# EAGLE board Maduino Zero 4G LTE CAT4 SIM7600X-H v1.3 (EAGLE 6.1)
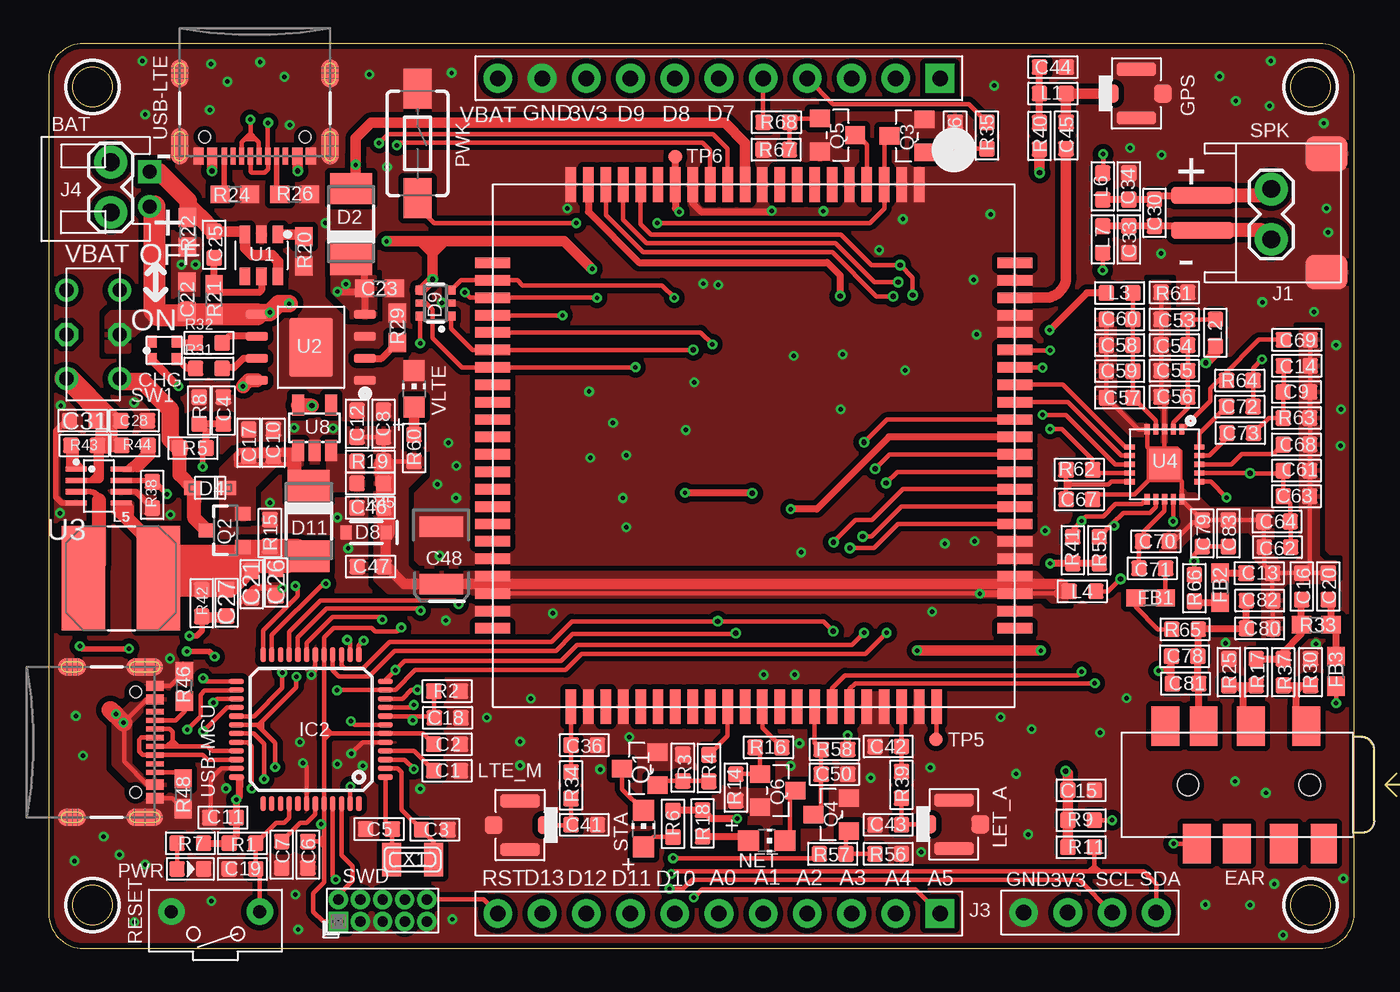
[diagram p2: board, top side]
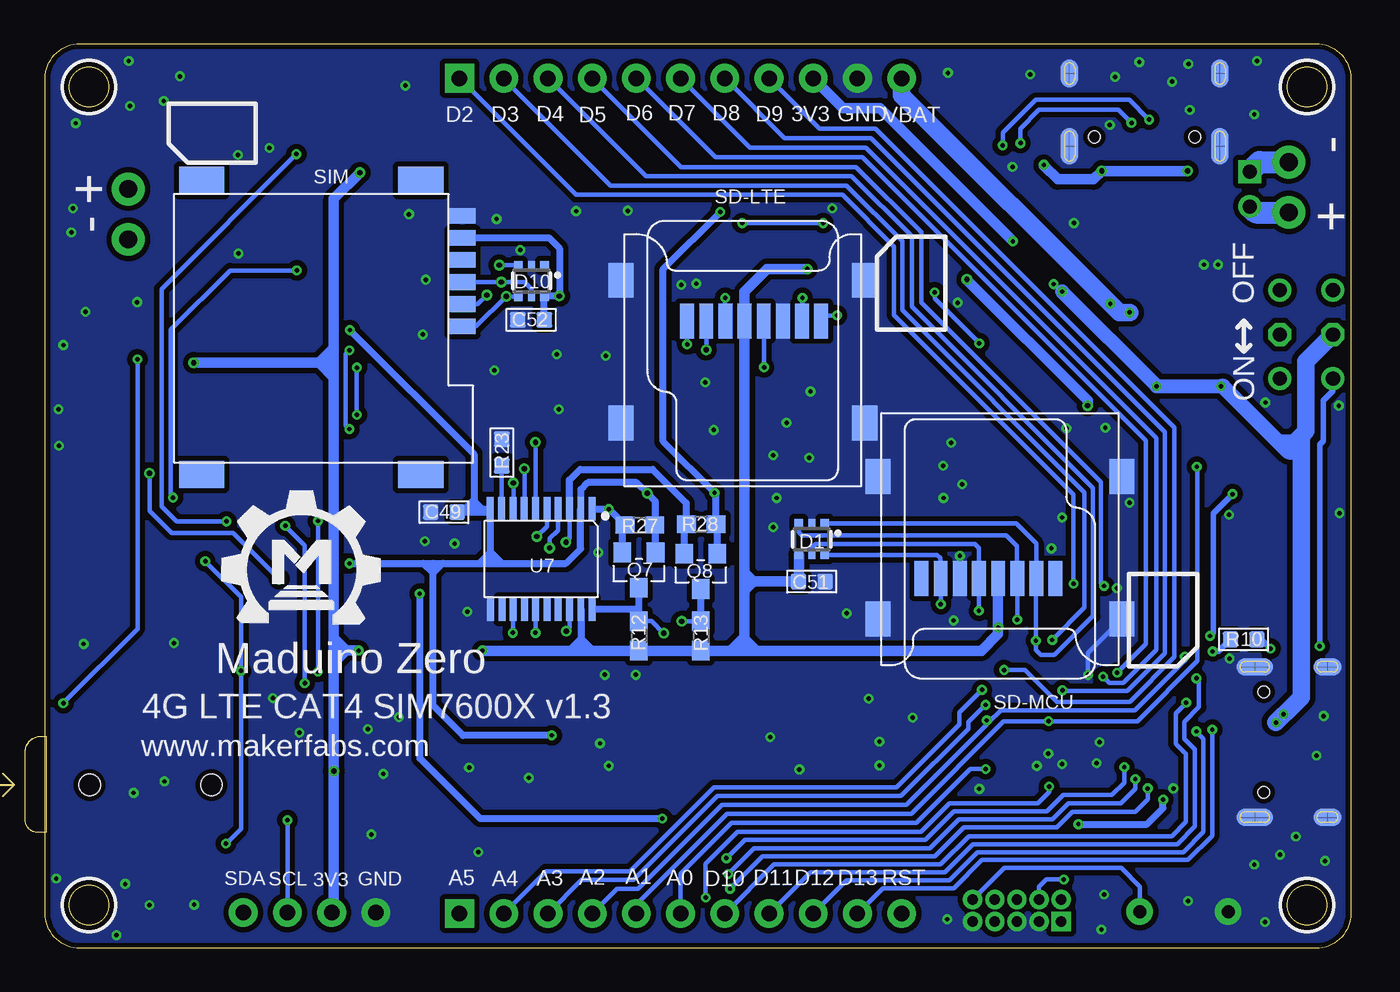
[diagram p3: board, bottom side, seen from below]

Size 75 x 52 mm. Coordinates in mm from the lower left corner, seen from the top.
Outline: 2,0 73,0 arc90 75,2 75,50 arc90 73,52 2,52 arc90 0,50 0,2 arc90 2,0
Outline: circle at 72.5,2.5 radius 1.14
Outline: circle at 72.5,49.5 radius 1.14
Outline: circle at 2.5,2.5 radius 1.14
Outline: circle at 2.5,49.5 radius 1.14
Copper layers (1*16): Top 0.035mm / dielectric 1.5mm / Bottom 0.035mm
Design rules: minimum track width 6mil, minimum drill 10mil, track to track 6mil, track to pad 6mil, pad to pad 6mil, via to via 6mil, smd to smd 0mil, copper to edge 10mil, drill to drill 10mil, minimum pad ring 10mil, minimum via ring 6mil, stop-mask expansion 2mil, vias tented up to drill 30mil, thermal gap 0mil
Net classes: 0 default: width 0.203 mm; 2 gnd: width 0.305 mm, drill 0.559 mm, clearance 0.254 mm; 3 usbvcc: width 0.508 mm, drill 0.61 mm, clearance 0.254 mm; 4 USBpair: width 0.254 mm, drill 0.406 mm, clearance 0.406 mm

## Footprints (pad centres in the part's own frame; a part is rotated, then mirrored left to right if it is on the bottom)
PH2.0-2P-90-DIP = drill 0.8 square: 1 0,1 | drill 0.8: 2 0,-1
0603 = smd 0.889 x 0.889: 1 -0.762,0; 2 0.762,0
0603' = smd 1.1 x 1: 1 -0.85,0; 2 0.85,0
C0603 = smd 0.889 x 0.889: 1 0,0.762; 2 0,-0.762
EIA3528 = smd 1.2 x 2.5: A 1.65,0; C -1.65,0
SMD4-160L160W = smd 0.6 x 0.7: 1 -0.7,0.5; 2 0.7,0.5; 3 -0.7,-0.5; 4 0.7,-0.5
PINHEAD_2X05_127 = drill 0.6 pad 1.016 square: 1 -0.635,2.54 | drill 0.6 pad 1.016: 2 0.635,2.54; 3 -0.635,1.27; 4 0.635,1.27; 5 -0.635,0; 6 0.635,0; 7 -0.635,-1.27; 8 0.635,-1.27; 9 -0.635,-2.54; 10 0.635,-2.54
SOT363 = smd 0.5 x 0.5: 1 -0.75,-0.9; 3 0.75,-0.9; 4 0.75,0.9; 6 -0.75,0.9 | smd 0.4 x 0.5: 2 0,-0.9; 5 0,0.9
DO-214AC = smd 1.8 x 2.4: A 2.025,0; C -2.025,0
SOD-323F = smd 1 x 0.8: A -1,0; C 1,0
SOD-323 = smd 0.63 x 0.83: A 1.15,0; C -1.15,0
AUDIO8P-SMD-3.5-14.5X6.1X4.0MM = smd 1.6 x 2.25: 1 3.9,-3.375; 2 7.1,-3.375; 3 9.8,-3.375; 4 10.2,3.375; 6 5.2,3.375; 7 7.9,3.375; 8 12,-3.375 | smd 1.5 x 2.25: 5 2.9,3.375 | hole 1.2: 3.7,0; 10.7,0
4P-U-FL = smd 1.016 x 1.016: D -1.524,0; GND3 1.524,0 | smd 2.286 x 0.762: GND1 0,1.397; GND2 0,-1.397
TQFP48-7X7 = smd 0.85 x 0.32: 1 -4.275,2.75; 2 -4.275,2.25; 3 -4.275,1.75; 4 -4.275,1.25; 5 -4.275,0.75; 6 -4.275,0.25; 7 -4.275,-0.25; 8 -4.275,-0.75; 9 -4.275,-1.25; 10 -4.275,-1.75; 11 -4.275,-2.25; 12 -4.275,-2.75; 25 4.275,-2.75; 26 4.275,-2.25; 27 4.275,-1.75; 28 4.275,-1.25; 29 4.275,-0.75; 30 4.275,-0.25; 31 4.275,0.25; 32 4.275,0.75; 33 4.275,1.25; 34 4.275,1.75; 35 4.275,2.25; 36 4.275,2.75 | smd 0.32 x 0.85: 13 -2.75,-4.275; 14 -2.25,-4.275; 15 -1.75,-4.275; 16 -1.25,-4.275; 17 -0.75,-4.275; 18 -0.25,-4.275; 19 0.25,-4.275; 20 0.75,-4.275; 21 1.25,-4.275; 22 1.75,-4.275; 23 2.25,-4.275; 24 2.75,-4.275; 37 2.75,4.275; 38 2.25,4.275; 39 1.75,4.275; 40 1.25,4.275; 41 0.75,4.275; 42 0.25,4.275; 43 -0.25,4.275; 44 -0.75,4.275; 45 -1.25,4.275; 46 -1.75,4.275; 47 -2.25,4.275; 48 -2.75,4.275
1X02_LOCK = drill 1.016 pad 1.88: 1 -0.178,0; 2 2.718,0
11P-2.54 = drill 0.889 pad 1.651 square: 1 0,12.7 | drill 0.889 pad 1.651: 2 0,10.16; 3 0,7.62; 4 0,5.08; 5 0,2.54; 6 0,0; 7 0,-2.54; 8 0,-5.08; 9 0,-7.62; 10 0,-10.16; 11 0,-12.7
4P-65/35ROUND = drill 0.889 pad 1.651: 1 0,3.81; 2 0,1.27; 3 0,-1.27; 4 0,-3.81
L0603 = smd 0.889 x 0.889: 1 -0.762,0; 2 0.762,0
SRN6045 = smd 2.5 x 6: 1 -2.175,0; 2 2.125,0
CHIP-LED0805 = smd 1.2 x 1.2: A 0,-1.05; C 0,1.05
TACTILE_SWITCH_SMD_6.0X3.5MM = smd 2.3 x 1.6: 1 -3.15,0; 2 3.15,0
LED-0603 = smd 0.889 x 0.889: + -0.762,0; - 0.762,0
SOT23 = smd 1.016 x 1.143: 1 -0.95,-1.016; 2 0.95,-1.016; 3 0,1.016
SOT23-3 = smd 0.8 x 0.9: 1 -0.95,-1; 2 0.95,-1; 3 0,1.1
R0603 = smd 0.889 x 0.889: 1 -0.762,0; 2 0.762,0
0603-NO = smd 1.1 x 1: 1 -0.85,0; 2 0.85,0
2P-7.62X3.56-90D = drill 0.762 pad 1.524: P$1 0,2.54; P$2 0,-2.54
8P-SMD = smd 0.8 x 2.008: 1 -3.198,0.254; 2 -2.098,0.254; 3 -0.998,0.254; 4 0.102,0.254; 5 1.202,0.254; 6 2.302,0.254; 7 3.402,0.254; 8 4.502,0.254 | smd 1.45 x 2: 9 -7.002,2.6; 10 7.002,2.6; 11 -7.002,-5.598; 12 7.002,-5.598
MICROSIM = smd 1.5 x 0.9: 1 -0.8,2.5; 2 -0.8,5.04; 3 -0.8,7.58; 5 -0.8,1.23; 6 -0.8,3.77; 7 -0.8,6.31 | smd 2.61 x 1.56: P$1 1.6,-0.8; P$2 14.2,-0.8; P$3 14.2,16.1; P$4 1.6,16.1
HW2-SMD-2.0-90D = smd 2 x 2.4: 3 3.4,-2.181; 4 -3.4,-2.181 | smd 1 x 3.6: + -1,4.953; - 1,4.953
6P-2CH-2.54-7.6X3.0 = drill 0.813 pad 1.27: CH1A -1.524,2.54; CH1B -1.524,-2.54; CH2A 1.524,2.54; CH2B 1.524,-2.54 | drill 0.813 pad 1.27 octagon: COM1 -1.524,0; COM2 1.524,0
PAD.03X.03 = smd 0.762 x 0.762: P$1 0,0
SOT-23-6 = smd 1 x 0.6: 1 -1.2,0.95; 2 -1.2,0; 3 -1.2,-0.95; 4 1.2,-0.95; 5 1.2,0; 6 1.2,0.95
SOP8-1.27P = smd 1.27 x 0.51: 1 -3.1,1.905; 2 -3.1,0.635; 3 -3.1,-0.635; 4 -3.1,-1.905; 5 3.1,-1.905; 6 3.1,-0.635; 7 3.1,0.635; 8 3.1,1.905 | smd 2.5 x 3.4: 9 0,0
TSOT23-8 = smd 1.2 x 0.3: 1 -1.3,0.975; 2 -1.3,0.325; 3 -1.3,-0.325; 4 -1.3,-0.975; 5 1.3,-0.975; 6 1.3,-0.325; 7 1.3,0.325; 8 1.3,0.975
QFN21-50P-400L400W = smd 0.6 x 0.3: 1 0,0; 2 0,-0.5; 3 0,-1; 4 0,-1.5; 5 0,-2; 11 4,-2; 12 4,-1.5; 13 4,-1; 14 4,-0.5; 15 4,0 | smd 0.3 x 0.6: 6 1,-3; 7 1.5,-3; 8 2,-3; 9 2.5,-3; 10 3,-3; 16 3,1; 17 2.5,1; 18 2,1; 19 1.5,1; 20 1,1 | smd 1.75 x 1.75: 21 2,-1
SMD87-100P-3000L300W = smd 2 x 0.6: 1 0,0; 2 0,-1; 3 0,-2; 4 0,-3; 5 0,-4; 6 0,-5; 7 0,-6; 8 0,-7; 9 0,-8; 10 0,-9; 11 0,-10; 12 0,-11; 13 0,-12; 14 0,-13; 15 0,-14; 16 0,-15; 17 0,-16; 18 0,-17; 19 0,-18; 20 0,-19; 41 30,-19; 42 30,-18; 43 30,-17; 44 30,-16; 45 30,-15; 46 30,-14; 47 30,-13; 48 30,-12; 49 30,-11; 50 30,-10; 51 30,-9; 52 30,-8; 53 30,-7; 54 30,-6; 55 30,-5; 56 30,-4; 57 30,-3; 58 30,-2; 59 30,-1; 60 30,0; 81 0,-20; 82 30,-20; 85 30,1 | smd 0.6 x 2: 21 5.5,-24.5; 22 6.5,-24.5; 23 7.5,-24.5; 24 8.5,-24.5; 25 9.5,-24.5; 26 10.5,-24.5; 27 11.5,-24.5; 28 12.5,-24.5; 29 13.5,-24.5; 30 14.5,-24.5; 31 15.5,-24.5; 32 16.5,-24.5; 33 17.5,-24.5; 34 18.5,-24.5; 35 19.5,-24.5; 36 20.5,-24.5; 37 21.5,-24.5; 38 22.5,-24.5; 39 23.5,-24.5; 40 24.5,-24.5; 61 24.5,5.5; 62 23.5,5.5; 63 22.5,5.5; 64 21.5,5.5; 65 20.5,5.5; 66 19.5,5.5; 67 18.5,5.5; 68 17.5,5.5; 69 16.5,5.5; 70 15.5,5.5; 71 14.5,5.5; 72 13.5,5.5; 73 12.5,5.5; 74 11.5,5.5; 75 10.5,5.5; 76 9.5,5.5; 77 8.5,5.5; 78 7.5,5.5; 79 6.5,5.5; 80 5.5,5.5; 83 25.5,-24.5; 84 4.5,-24.5; 86 4.5,5.5; 87 25.5,5.5
TSSOP20-0.65-6.5X4.4MM = smd 0.4 x 1.35: 1 -2.925,-2.875; 2 -2.275,-2.875; 3 -1.625,-2.875; 4 -0.975,-2.875; 5 -0.325,-2.875; 6 0.325,-2.875; 7 0.975,-2.875; 8 1.625,-2.875; 9 2.275,-2.875; 10 2.925,-2.875; 11 2.91,2.875; 12 2.26,2.875; 13 1.61,2.875; 14 0.96,2.875; 15 0.325,2.875; 16 -0.325,2.875; 17 -0.975,2.875; 18 -1.625,2.875; 19 -2.275,2.875; 20 -2.925,2.875
SOT23-5 = smd 0.69 x 1.2: 1 -0.95,-1.3; 2 0,-1.3; 3 0.95,-1.3; 4 0.95,1.3; 5 -0.95,1.3
USB-C-16P-5 = smd 0.3 x 1: A5 -1.25,-0.34; A6 -0.25,-0.34; A7 0.25,-0.34; A8 1.25,-0.34; B5 1.75,-0.34; B6 0.75,-0.34; B7 -0.75,-0.34; B8 -1.75,-0.34 | smd 0.6 x 1: GND -3.225,-0.34; GND2 3.225,-0.34; VBUS1 -2.45,-0.34; VBUS2 2.45,-0.34 | smd 1 x 2.1: SHLD1 -4.32,-0.915; SHLD2 4.32,-0.915 | smd 1 x 2.1 bottom: SHLD3 -4.32,-0.915; SHLD4 4.32,-0.915 | smd 1 x 1.6: SHLD5 -4.32,-5.095; SHLD8 4.32,-5.095 | smd 1 x 1.6 bottom: SHLD6 -4.32,-5.095; SHLD7 4.32,-5.095 | hole 0.65: -2.89,-1.445; 2.89,-1.445
XTAL3215 = smd 1.1 x 1.9: P$1 1.2,0; P$2 -1.2,0

## Placement (x,y rotation side)
BAT  PH2.0-2P-90-DIP  [PH2.0-2P-90-DIP]  5.79,43.64 0 top
C1  1uF  [0603]  22.89,10.21 0 top
C2  100nF  [0603]  22.89,11.73 180 top
C3  22pF  [0603]  22.17,6.83 0 top
C4  0.1uF  [0603]  10.03,30.91 90 top
C5  22pF  [0603]  18.97,6.86 180 top
C6  100nF  [0603]  14.88,5.38 270 top
C7  1uF  [0603]  13.39,5.38 270 top
C8  10uF  [0603]  19.23,30.15 270 top
C9  10pF  [0603]  71.68,31.98 180 top
C10  4.7uF  [0603]  12.9,29.06 270 top
C11  4.7uF  [0603]  10.01,7.52 0 top
C12  1uF  [0603]  17.7,30.15 270 top
C13  1uF  [0603]  69.55,21.56 0 top
C14  100nF  [0603]  71.7,33.48 180 top
C15  100nF  [0603]  59.31,9.09 0 top
C16  10pF  [0603]  71.98,20.8 270 top
C17  10uF  [0603]  11.48,29.06 270 top
C18  0.1uF  [0603]  22.91,13.26 0 top
C19  0.1uF  [0603]  11.13,4.57 0 top
C20  10pF  [0603]  73.51,20.8 270 top
C21  10uF  [0603]  11.66,20.93 90 top
C22  10uF  [0603']  7.92,37.44 90 top
C23  1.0uF  [0603']  19,37.92 0 top
C25  0.1uF  [0603]  9.5,40.44 270 top
C26  1uF  [0603]  13.06,21.03 90 top
C27  33pF  [0603]  10.21,19.86 90 top
C28  10uF  [0603]  4.9,30.33 180 top
C30  NC  [C0603]  63.53,42.27 0 top
C31  0.1uF  [0603]  1.96,30.33 0 top
C33  33pF  [C0603]  62.05,40.74 0 top
C34  33pF  [C0603]  62.05,43.79 180 top
C36  NC  [0603]  30.76,11.68 180 top
C41  NC  [0603]  30.76,7.11 180 top
C42  NC  [0603]  48.23,11.61 0 top
C43  NC  [0603]  48.23,7.11 0 top
C44  33pF  [0603]  57.68,50.65 0 top
C45  0R  [0603]  58.45,46.71 270 top
C46  10uF  [0603]  18.47,25.32 0 top
C47  1uF  [0603]  18.49,21.95 0 top
C48  100uF  [EIA3528]  22.56,22.58 270 top
C49  100nF  [0603]  52.1,25.07 0 bottom
C50  0.1uF  [0603]  45.14,10.01 180 top
C51  100nF  [0603]  30.96,21.08 0 bottom
C52  0.1uF  [0603]  47.09,36.12 0 bottom
C53  10uF  [0603]  64.67,36.14 0 top
C54  0.1uF  [0603]  64.67,34.67 0 top
C55  10pF  [0603]  64.67,33.2 0 top
C56  33pF  [0603]  64.67,31.7 0 top
C57  10uF  [0603]  61.52,31.65 0 top
C58  0.1uF  [0603]  61.52,34.67 0 top
C59  10pF  [0603]  61.52,33.17 0 top
C60  33pF  [0603]  61.52,36.14 0 top
C61  10uF  [0603]  71.68,27.46 180 top
C62  0.1uF  [0603]  70.59,23.06 0 top
C63  10pF  [0603]  71.68,25.98 180 top
C64  33pF  [0603]  70.56,24.54 0 top
C67  10pF  [0603]  59.21,25.81 180 top
C68  4.7uF  [0603]  71.68,28.96 180 top
C69  4.7uF  [0603]  71.7,34.98 180 top
C70  10pF  [0603]  63.6,23.39 180 top
C71  1uF  [0603]  63.4,21.84 180 top
C72  1uF  [0603]  68.43,31.14 180 top
C73  1uF  [0603]  68.45,29.62 180 top
C78  10pF  [0603]  65.25,16.79 0 top
C79  10pF  [0603]  66.27,23.85 270 top
C80  10pF  [0603]  69.57,18.39 0 top
C81  10pF  [0603]  65.3,15.21 0 top
C82  10pF  [0603]  69.57,19.99 0 top
C83  10pF  [0603]  67.77,23.85 270 top
CHG  [SMD4-160L160W]  6.63,34.37 180 top
CN2  PINHEAD-2x5-P1.27  [PINHEAD_2X05_127]  19.18,2.18 90 top
D1  SMF05C  [SOT363]  30.96,23.52 180 bottom
D2  SS34  [DO-214AC]  17.37,41.63 90 top
D4  [SOD-323F]  9.27,26.47 0 top
D8  5.6V  [SOD-323]  18.24,23.9 180 top
D9  SMF05C  [SOT363]  22.23,37.08 90 top
D10  SMF05C  [SOT363]  47.07,38.35 180 bottom
D11  SS34  [DO-214AC]  14.94,24.56 270 top
EAR  AUDIO-JACK-8P-SMD  [AUDIO8P-SMD-3.5-14.5X6.1X4.0MM]  76.15,9.4 180 top
FB1  120Ω  [0603']  63.3,20.14 180 top
FB2  120Ω  [0603']  67.28,20.73 270 top
FB3  120Ω  [0603']  73.96,15.93 90 top
GPS  [4P-U-FL]  62.48,49.12 0 top
IC2  SAMD21G18A-AUT  [TQFP48-7X7]  15.06,12.6 180 top
J1  [1X02_LOCK]  70.23,43.46 270 top
J2  [11P-2.54]  38.5,50 270 top
J3  [4P-65/35ROUND]  59.82,2.06 270 top
J4  [1X02_LOCK]  3.56,42.47 90 top
J8  [11P-2.54]  38.5,2 270 top
L1  47nH  [L0603]  57.68,49.12 0 top
L2  47nH  [L0603]  67.03,35.38 90 top
L3  47nH  [L0603]  61.52,37.67 0 top
L4  47nH  [L0603]  59.39,20.52 0 top
L5  4.7µH/±20%/3A  [SRN6045]  4.17,21.29 0 top
L6  120R  [L0603]  60.55,43.79 270 top
L7  120R  [L0603]  60.55,40.74 90 top
LET_A  [4P-U-FL]  51.99,7.14 0 top
LTE_M  [4P-U-FL]  27.08,7.09 180 top
NET  NET  [CHIP-LED0805]  41.25,6.2 270 top
PWK  MOMENTARY-SWITCH-SPST-SMD-6.0X3.5MM  [TACTILE_SWITCH_SMD_6.0X3.5MM]  21.18,46.25 270 top
PWR  RED  [LED-0603]  8.13,4.57 0 top
Q1  BC847C  [SOT23]  33.96,10.34 90 top
Q2  MOSFET-PCHANNEL  [SOT23-3]  10.16,24.03 90 top
Q3  2N7002  [SOT23]  49.3,46.69 90 top
Q4  2N7002  [SOT23]  44.96,7.7 90 top
Q5  2N7002  [SOT23]  45.31,46.74 270 top
Q6  BC847C  [SOT23]  41.88,9.07 270 top
Q7  NC  [SOT23]  40.89,21.74 180 bottom
Q8  NC  [SOT23]  37.34,21.67 180 bottom
R1  10k  [R0603]  11.13,6.05 180 top
R2  1M  [R0603]  22.89,14.78 180 top
R3  10K  [R0603]  36.42,10.39 270 top
R4  1K  [R0603]  37.92,10.36 90 top
R5  1M/1%  [R0603]  8.28,28.75 180 top
R6  1K  [R0603]  35.86,7.16 90 top
R7  1K  [R0603]  8.13,6.05 180 top
R8  1M/1%  [R0603]  8.64,30.91 270 top
R9  4.7K  [R0603]  59.31,7.37 180 top
R10  1M  [R0603]  6.15,17.75 0 bottom
R11  4.7K  [R0603]  59.31,5.82 180 top
R12  30K  [0603']  40.89,17.96 270 bottom
R13  30K  [0603']  37.34,17.96 270 bottom
R14  10K  [R0603]  39.47,9.25 90 top
R15  100k  [R0603]  12.7,23.88 90 top
R16  1K  [R0603]  41.35,11.56 0 top
R17  NC  [R0603]  69.37,15.88 270 top
R18  1K  [R0603]  37.57,7.19 90 top
R19  0R  [R0603]  18.47,27.99 180 top
R20  1K  [0603']  14.66,40.06 90 top
R21  100R  [0603']  9.5,37.29 90 top
R22  NC  [0603']  7.98,41.15 270 top
R23  10K  [R0603]  48.77,28.5 270 bottom
R24  5.1K  [0603-NO]  10.69,43.33 0 top
R25  0R  [R0603]  67.79,15.88 90 top
R26  5.1K  [0603-NO]  14.12,43.33 0 top
R27  10K  [0603']  40.84,24.33 0 bottom
R28  10K  [0603']  37.31,24.38 0 bottom
R29  1.2k  [0603']  20.02,35.66 270 top
R30  NC  [R0603]  72.49,15.88 90 top
R31  47R  [R0603]  9.19,33.32 0 top
R32  47R  [R0603]  9.19,34.8 0 top
R33  68R  [0603-NO]  72.82,18.59 0 top
R34  0R  [R0603]  30,9.37 270 top
R35  1K  [R0603]  53.9,46.71 90 top
R36  10K  [R0603]  52.07,46.71 270 top
R37  0R  [R0603]  70.92,15.88 270 top
R38  33K  [R0603]  5.94,26.06 90 top
R39  0R  [R0603]  49,9.4 270 top
R40  10R  [R0603]  56.92,46.69 270 top
R41  2.2K  [R0603]  58.83,22.89 90 top
R42  200K  [R0603]  8.79,19.84 90 top
R43  100K  [R0603]  2.03,28.91 0 top
R44  200K  [R0603]  4.95,28.91 180 top
R45  0R  [R0603]  18.47,26.72 180 top
R46  5.1K  [0603-NO]  7.8,15.06 90 top
R48  5.1K  [0603-NO]  7.72,8.89 270 top
R55  2.2K  [R0603]  60.35,22.89 90 top
R56  10K  [R0603]  48.23,5.44 180 top
R57  1K  [R0603]  45.03,5.44 180 top
R58  2.2K  [R0603]  45.14,11.43 0 top
R60  1K  [R0603]  20.98,28.75 270 top
R61  0R  [R0603]  64.67,37.69 180 top
R62  0  [R0603]  59.21,27.51 0 top
R63  2.2K  [R0603]  71.68,30.48 180 top
R64  2.2K  [R0603]  68.43,32.64 180 top
R65  0R  [R0603]  65.28,18.34 180 top
R66  0  [R0603]  65.81,20.7 270 top
R67  10K  [R0603]  41.78,45.9 0 top
R68  1K  [R0603]  41.81,47.47 180 top
RESET  [2P-7.62X3.56-90D]  9.58,2.11 270 top
SD-LTE  SD  [8P-SMD]  34.92,35.79 0 bottom
SD-MCU  SD  [8P-SMD]  20.16,21.53 180 bottom
SIM  MICROSIM  [MICROSIM]  51.82,43.33 180 bottom
SPK  JST-2P  [HW2-SMD-2.0-90D]  71.22,42.27 90 top
STA  STATUS  [CHIP-LED0805]  34.16,6.88 0 top
SW1  [6P-2CH-2.54-7.6X3.0]  2.54,35.28 180 top
TP5  TEST-POINT3  [PAD.03X.03]  50.98,12.01 0 top
TP6  TEST-POINT3  [PAD.03X.03]  35.99,45.49 0 top
U1  DW06D  [SOT-23-6]  12.22,39.83 270 top
U2  TP4056  [SOP8-1.27P]  15.06,34.54 180 top
U3  MP2143DJ-LF-Z  [TSOT23-8]  2.87,26.57 0 top
U4  NAU8810  [QFN21-50P-400L400W]  65.1,29.82 270 top
U6  SIM7600  [SMD87-100P-3000L300W]  50,43.89 270 top
U7  TXS0108E  [TSSOP20-0.65-6.5X4.4MM]  46.51,22.38 180 bottom
U8  SPX3819  [SOT23-5]  15.27,29.92 0 top
U$1  [MAKERFABS_0.3]  64.4,18.69 0 bottom
USB-LTE  [USB-C-16P-5]  11.84,45.19 180 top
USB-MCU  [USB-C-16P-5]  6.43,11.86 270 top
VLTE  LED2  [CHIP-LED0805]  20.98,32.16 0 top
X1  32.768K  [XTAL3215]  20.9,5.11 0 top

## Tracks (layer width: path | path; a pad name or v marks a point on that pad's centre or on a via)
1.8V  (via drill 0.25, 0.3)
  Top 0.406: TP6.P$1 U6.15 36,42.54 v36.22,42.32 | v57.53,22.12 R41.1 R55.1 | v40.41,26.16 36.58,26.16 v36.55,26.19 | R58.2 v45.9,12.24 | L3.1 59.64,37.67 v57.51,35.53
  Bottom 0.254: U7.10
  Bottom 0.406: Q8.1 36.39,24.31 R28.2 36.46,26.1 v36.55,26.19 39.5,29.13 39.5,39.04 v36.22,42.32 | Q7.1 39.94,24.28 | 39.94,24.28 R27.2 | 39.94,24.28 39.94,25.7 v40.41,26.16 41.02,26.77 43.84,26.77 44.23,26.38 U7.2 44.25,25.24 44.25,22.96 45.09,22.12 48.77,22.12 | v57.53,22.12 53.29,22.12 | 53.29,22.12 52.7,22.12 | 52.7,22.12 52.17,22.12 | 52.17,22.12 50.09,22.12 | 50.09,22.12 49.53,22.12 | 49.53,22.12 48.77,22.12 | 49.53,22.12 49.43,22.22 U7.10 49.62,25.07 50.67,25.07 | C49.2 51.08,25.07 | 51.08,25.07 50.67,25.07 | 50.37,25.7 50.37,28.4 v57.51,35.53 | 50.37,25.7 50.37,25.38 50.67,25.07 | v45.9,12.24 51,12.24 52.73,13.97 52.73,21.57 | 52.73,21.57 52.73,22.1 52.7,22.12 | 52.17,22.12 52.73,21.57 | 52.73,21.57 53.29,22.12 | 48.77,22.12 49.43,22.78 50.09,22.12 | 49.45,25.22 49.89,25.22 50.37,25.7 | 50.37,25.7 50.44,25.7 51.08,25.07
+3V3  (via drill 0.25, 0.3)
  Top 0.254: 10.79,7.54 C11.2 | 15.81,12.32 IC2.17 15.81,17.87 16.36,18.41 18.54,18.41 18.75,18.21 20.02,18.21 v20.24,18.44 | 15.81,12.32 15.81,12.09 | 15.81,12.09 IC2.44 15.81,7.14 | 15.81,12.32 15.84,12.35 IC2.6 21.51,12.35 C2.2 | 15.81,7.14 15.81,6.17 | 15.81,6.17 15.81,3.8 15.19,3.17 15.19,2.11 15.75,1.55 CN2.1 | C6.1 15.52,6.15 | 15.54,6.15 15.79,6.15 15.81,6.17 | v15.65,7.14 15.81,7.14 | IC2.36 10.77,9.83 10.77,9.8 10.87,9.8 10.87,9.3 11.05,9.3 11.05,9.78 11.02,9.8 | 15.82,12.75 16.23,12.34 16.15,12.34 15.82,12.01 15.82,12.08 15.81,12.09 | 15.52,6.15 15.54,6.15 | 15.54,6.15 15.8,6.4 | 15.52,6.15 15.8,5.87
  Top 0.406: R7.1 R1.2 10.77,6.45 C11.2 | 10.79,7.54 10.79,8.54 v10.77,8.56 10.95,8.74 10.95,9.37 10.95,9.73 11.02,9.8
  Top 0.61: v56.92,44.58 R40.2 | v49.89,17.12 v57,17.12 | v19.41,40.64 21.36,40.64 | 21.36,40.64 22.17,40.64 | 22.17,40.64 22.73,40.64 | 22.73,40.64 29.62,40.64 v31.22,39.04 | 22.05,39.95 v22.05,38.46 21.43,37.83 D9.4 | 22.05,39.95 22.05,40.51 22.17,40.64 | 21.36,40.64 22.05,39.95 | 22.05,39.95 22.73,40.64 | C15.1 R9.2 R11.2 58.55,10.06 v58.42,10.19 | L2.1 67.03,34.21 v66.47,33.66
  Top 0.813: v15.11,31.19 14.35,31.19 arc-90 U8.5
  Bottom 0.254: 20.24,21.26 SD-MCU.4
  Bottom 0.406: v15.65,7.14 11.7,7.14 10.79,8.05 10.79,8.54 v10.77,8.56 | 31.71,21.09 C51.1 | 34.16,21.08 34.8,21.08 34.82,21.11 | U7.19 44.23,17.12 44.25,17.11 | 43.59,17.17 44.22,17.8 44.88,17.14 44.34,17.14 44.3,17.11 | 34.82,21.67 34.75,21.67 34.16,21.08 | 34.16,21.08 34.8,20.45
  Bottom 0.61: 34.75,17.11 21.22,17.11 20.26,18.07 20.26,18.43 | 34.75,17.11 R13.2 R12.2 44.25,17.11 44.3,17.11 49.87,17.11 v49.89,17.12 | 34.82,17.78 34.82,21.11 34.82,21.67 SD-LTE.4 34.82,37.74 33.53,39.04 v31.22,39.04 | 34.82,17.78 34.82,17.18 34.75,17.11 | D1.4 31.71,21.09 | C51.1 34.16,21.08 | 58.42,16.41 58.42,17.12 | 58.42,17.12 58.42,17.83 | 58.42,17.83 58.42,32.82 | 58.42,32.82 58.42,33.66 | v57,17.12 57.71,17.12 | 57.71,17.12 58.42,17.12 | 34.82,17.78 34.16,17.12 35.61,17.12 | 35.66,17.12 35.61,17.12 | 35.61,17.12 34.85,17.88 | 58.42,17.83 57.71,17.12 | 57.71,17.12 58.42,16.41 | v66.47,33.66 59.26,33.66 | 59.26,33.66 58.42,33.66 | 58.42,33.66 58.42,34.49 | 58.42,34.49 58.42,43.08 v56.92,44.58 | 58.42,34.49 59.26,33.66 | 59.26,33.66 58.42,32.82 | J2.9 29.16,48.28 27.05,48.28 v19.41,40.64 | 20.26,18.43 SD-MCU.4 | v20.24,18.44 20.26,18.43 | 58.42,16.41 v58.42,10.19 58.42,2.18 J3.3 | v15.11,31.19 15.11,31.47 22.07,38.43 v22.05,38.46
A0  (via drill 0.25)
  Top 0.254: IC2.3 20.45,10.85 v20.98,10.31
  Bottom 0.254: J8.6 38.5,4.3 35.59,7.21 24.94,7.21 21.84,10.31 v20.98,10.31
A1  (via drill 0.25)
  Top 0.254: IC2.7 17.55,12.85 v17.35,13.06
  Top 0.305: R5.1 8.84,28.55 v8.84,27.69 | C4.1 10.06,30.15
  Top 0.406: R5.1 9.04,29.74 R8.2 9.91,30.15 10.01,30.05 10.01,30.1 10.06,30.15
  Bottom 0.254: J8.5 41.04,2.55 35.84,7.75 25.25,7.75 19.94,13.06 v17.35,13.06 12.27,13.06 8.81,16.51 8.81,27.69 8.81,27.74
  Bottom 0.305: v8.84,27.69 8.81,27.69
A2  (via drill 0.25)
  Top 0.254: C18.1 22.15,14.76 R2.2 | 22.05,13.36 C18.1 | IC2.8 20.83,13.35 | 20.83,13.35 22.06,13.35 C18.1 | v20.9,13.11 20.9,13.27 20.83,13.35
  Top 0.305: v7.92,17.07 9.22,17.07 v9.53,16.76
  Bottom 0.254: J8.4 42.15,3.43 40.95,3.43 36.12,8.26 25.53,8.26 20.93,12.85 | 20.93,12.85 20.8,12.98 | 20.8,12.98 20.09,13.69 12.39,13.69 9.53,16.56 9.53,16.74 v9.53,16.76 | 20.93,12.88 20.93,12.85 | v20.9,13.11 20.9,13.08 20.8,12.98
  Bottom 0.305: 9.53,16.56 9.53,16.74 | v7.92,17.07 7.59,17.07 R10.1
A3  (via drill 0.25)
  Top 0.254: IC2.9 20.83,13.85 v20.98,13.99
  Bottom 0.254: J8.3 44.18,3.94 41.2,3.94 36.37,8.76 25.83,8.76 21.97,12.62 21.97,13.01 v20.98,13.99
A4  (via drill 0.25)
  Top 0.254: IC2.10 20.32,14.35 20.83,14.86 v21.18,14.86
  Bottom 0.254: J8.2 46.22,4.45 41.4,4.45 36.58,9.27 26.09,9.27 22.48,12.88 22.48,13.56 v21.18,14.86
A5  (via drill 0.25)
  Top 0.254: v37.06,2.92 37.54,3.4 49.78,3.4 51.19,2 J8.1 | IC2.47 17.32,8.33 v17.32,9.3
  Bottom 0.254: v37.06,2.92 37.06,4.88 35.23,6.71 24.69,6.71 23.06,8.33 17.98,8.33 17.32,8.99 v17.32,9.3
AGND
  Top 0.254: U4.21 U4.3 64.1,31.5 C56.1 C55.1 C54.1 C53.1 R61.2 | U4.21 63.1,28.82 U4.5 62.59,29.82 C57.1 C59.1 C58.1 C60.1 | C67.1 60.25,26.09 62.37,26.09 U4.21 | U4.21 65.1,26.82 U4.15 65.1,25.78 C79.1 | C14.1 72.47,26.01 C63.1 | C13.2 C16.1 | C16.1 72.49,21.57 | 72.49,21.57 C20.1 C16.1 | C63.1 72.44,21.61 72.49,21.57 | C79.1 C83.1 69.72,24.61 C64.1 69.8,23.09 C62.1 69.83,22.05 C13.2 | C13.2 70.31,20.02 C82.2 C80.2 | C70.1 64.64,23.39 65.73,24.49 66.14,24.49 C79.1 | C69.1 C14.1 | C14.1 72.47,32 C9.1 R63.1 | C68.1 C61.1 C63.1
  pour Top: 60.27,36.53 60.27,31.42 62.2,29.49 63.09,29.49 63.09,30.07 62.46,30.07 61.24,31.29 61.24,36.53
  pour Top: 63.35,38.28 63.35,31.6 64.01,30.94 64.01,28.8 64.19,28.8 64.19,31.14 64.36,31.32 64.36,38.28
  pour Top: 71.93,35.56 71.93,22.43 71.68,22.17 70.64,22.17 70.31,22.5 70.31,25.25 66.67,25.25 65.84,26.09 65.41,26.09 65.15,26.34 65.07,26.34 65.07,24.26 64.72,23.9 63.88,23.9 63.88,22.83 64.72,22.83 65.86,23.98 68.99,23.98 69.14,23.83 69.29,23.67 69.29,22.45 69.7,22.05 69.77,21.97 69.77,17.91 70.79,17.91 70.79,20.73 71.12,21.06 73.91,21.06 73.91,22.17 73.25,22.17 72.9,22.53 72.9,35.53 72.92,35.56
AREFA
  Top 0.254: IC2.4 20.99,11.35 C1.1
CTS  (via drill 0.3)
  Top 0.254: U6.67 48.99,25.39 47.27,23.67 v46.76,23.67
  Bottom 0.254: U7.5 46.18,24.25 v46.76,23.67
D0  (via drill 0.3)
  Top 0.254: IC2.16 16.31,15.97 16.66,15.62 18.39,15.62 19.86,17.09 29.13,17.09 30.1,18.06 39.42,18.06 v39.47,18.11
  Bottom 0.254: R12.1 40.17,18.81 v39.47,18.11
  Bottom 0.406: R12.1 40.89,19.46 | 40.89,19.46 Q7.3 | U7.20 40.94,19.5 40.89,19.46
D1  (via drill 0.3)
  Top 0.254: IC2.15 16.81,16.26 16.97,16.1 18.06,16.1 19.58,17.63 28.88,17.63 30.05,18.8 v38.43,18.8 44.5,18.8 v45.06,18.24
  Bottom 0.254: U7.18 44.88,18.41 v45.06,18.24 | R13.1 37.35,18.8 v38.43,18.8
  Bottom 0.406: R13.1 Q8.3
D2  (via drill 0.25)
  Top 0.254: 12.83,16.89 IC2.23 12.81,16.91 12.8,16.92 12.8,18.01 15.75,20.95 v15.93,20.95
  Bottom 0.254: v15.93,20.95 15.93,26.09 26.24,36.4 26.24,40.34 29.21,43.31 44.51,43.31 J2.1
D3  (via drill 0.25)
  Top 0.254: IC2.14 17.31,17.56 v17.14,17.73
  Bottom 0.254: v17.14,17.73 15.29,19.58 15.29,26.21 25.76,36.68 25.76,40.64 28.96,43.84 42.52,43.84 48.66,49.98 J2.2
D4  (via drill 0.25)
  Top 0.254: IC2.13 17.81,17.41 v18.09,17.68
  Bottom 0.254: D1.1 19.21,24.42 18.06,23.27 SD-MCU.2 18.09,21.24 v18.09,17.68 18.09,17.15 IC2.13 17.04,16.87 14.81,19.1 14.81,26.47 25.22,36.88 25.22,40.92 28.68,44.37 40.49,44.37 J2.3
D5  (via drill 0.25)
  Top 0.254: J2.4 45.06,48.51 52.86,48.51 R35.2 | v14.17,20.83 arc-90 14.3,20.7 14.3,20.24 12.32,18.26 12.32,16.82 12.31,16.82 IC2.24
  Bottom 0.254: v14.17,20.83 14.35,21.01 14.35,26.8 24.66,37.11 24.66,41.15 28.42,44.91 38.49,44.91 J2.4
D6  (via drill 0.25)
  Top 0.254: R68.2 J2.5 | IC2.29 11.8,13.35 13.41,14.96 v13.41,15.85
  Bottom 0.254: v13.41,15.85 11.76,17.5 11.76,29.18 28.04,45.47 36.51,45.47 J2.5
D7  (via drill 0.25)
  Top 0.254: 43.97,5.13 R57.2 44.02,5.18 v35.87,5.18 | IC2.30 11.96,12.85 | 11.96,12.85 13.01,11.81 v13.01,10.41 | 12.06,12.85 11.96,12.85 | 12.06,12.85 14.22,15.01 v14.22,15.62 | 12.27,13.03 12.27,12.88 | 12.27,12.88 12.27,12.57 | 12.06,12.85 12.24,12.85 12.27,12.88
  Bottom 0.254: v35.87,5.18 34.8,6.25 24.43,6.25 22.81,7.87 17.45,7.87 16.51,8.81 13.72,8.81 13.01,9.53 v13.01,10.41 | v14.22,15.62 13.87,15.27 13.06,15.27 11.18,17.14 11.18,29.16 11.18,29.34 27.86,46.02 34.52,46.02 J2.6
D8  (via drill 0.25)
  Top 0.254: v16.56,14.83 16.58,14.85 IC2.11 19.91,14.86 21.06,16 29.69,16 30.61,16.92 46.91,16.92 v48.13,18.14
  Bottom 0.254: v16.56,14.83 16.54,14.81 12.83,14.81 10.67,16.97 10.67,29.67 27.56,46.56 32.52,46.56 J2.7 | U7.13 48.12,18.15 v48.13,18.14
D9  (via drill 0.25)
  Top 0.254: IC2.12 19.34,15.43 v19.91,16 20.45,16.54 29.44,16.54 30.35,17.45 46.15,17.45 v46.84,18.14
  Bottom 0.254: J2.8 30.51,47.09 27.3,47.09 10.13,29.92 10.13,16.74 12.7,14.17 16.89,14.17 18.72,16 v19.91,16 | U7.15 v46.83,18.14 v46.84,18.14
D10  (via drill 0.25)
  Top 0.254: IC2.27 9.68,14.35 v9.45,14.12
  Bottom 0.254: J8.7 33.13,4.83 23.57,4.83 21.95,6.45 10.29,6.45 9.47,7.26 9.47,11.18 10.06,11.76 10.06,13.51 v9.45,14.12
D11  (via drill 0.25)
  Top 0.254: IC2.25 9.04,15.35 v8.87,15.52
  Bottom 0.254: J8.8 31.05,4.37 23.32,4.37 21.69,5.99 9.96,5.99 8.94,7.01 8.94,11.43 9.55,12.04 9.55,13.03 8.71,13.87 8.71,15.37 v8.87,15.52
D12  (via drill 0.25)
  Top 0.254: IC2.28 10.24,13.85 v8.87,12.47
  Bottom 0.254: J8.9 28.97,3.91 23.06,3.91 21.44,5.54 9.63,5.54 8.46,6.71 8.46,12.04 8.87,12.45 v8.87,12.47
D13  (via drill 0.25)
  Top 0.254: IC2.26 10.77,14.83 8.97,14.83 8.71,14.58 8.71,13.34 v7.95,12.57
  Bottom 0.254: J8.10 26.89,3.45 22.81,3.45 21.18,5.08 9.35,5.08 7.95,6.48 v7.95,12.57
D+
  Top 0.254: IC2.34 9.12,10.85 8.85,11.11 USB-MCU.B6 5.4,11.11 5.18,11.33 5.18,11.99 5.31,12.12 USB-MCU.A6
D-
  Top 0.254: IC2.33 9.38,11.35 9.12,11.61 7.11,11.61 | USB-MCU.A7 7.11,11.61 | USB-MCU.B7 6.95,12.61 7.11,12.45 7.11,11.94 | 7.11,11.94 7.11,11.61 | 7.11,11.94 6.81,11.63 7.39,11.63 7.14,11.89
DCD  (via drill 0.3)
  Top 0.254: U6.70 48.3,28.39 v47.47,27.56
  Bottom 0.254: v47.47,27.56 47.47,25.26 U7.7
DN  (via drill 0.25)
  Top 0.254: U6.12 38.99,43.89 38.99,45.95 38.15,46.79 19.48,46.79 v18.97,46.28 | USB-LTE.A7 11.59,44.65 11.66,44.58 12.39,44.58 12.6,44.78 12.6,45.52 USB-LTE.B7 12.59,47.44 v12.6,47.45
  Bottom 0.254: v18.97,46.28 18.97,47.12 17.91,48.18 13.34,48.18 v12.6,47.45
DONE
  Top 0.406: U2.6 10.36,35.18 10.01,34.82 9.98,34.82 R32.2
DP  (via drill 0.25)
  Top 0.254: 11.25,46.51 11.09,46.34 USB-LTE.B6 11.1,45.51 | 11.25,46.51 11.63,46.51 | 11.63,46.51 11.89,46.51 | 11.89,46.51 12.06,46.33 12.06,45.55 USB-LTE.A6 | U6.13 38,45.87 37.57,46.3 20.14,46.3 v19.99,46.15 | v11.58,47.62 11.58,46.84 | 11.58,46.81 11.58,46.56 11.63,46.51 | 11.25,46.51 11.58,46.84 | 11.58,46.84 11.58,46.81 | 11.58,46.81 11.89,46.51
  Bottom 0.254: v19.99,46.15 19.99,46.86 18.09,48.77 12.72,48.77 v11.58,47.62
DTR  (via drill 0.3)
  Top 0.254: U6.72 48.15,30.39 v46.84,29.08
  Bottom 0.254: v46.84,29.08 U7.6
EAR_N
  Top 0.406: FB2.1 67.3,21.57 C13.1
EAR_P
  Top 0.254: FB1.1 64.16,20.16 C71.1
FLIGHTMODE
  Top 0.254: U6.54 44,11.8 R58.1 C50.2 44.37,8.13 Q4.3
GND  (via drill 0.25)
  Top 0.254: IC2.35 9.89,10.35 9.3,9.75 9.3,7.57 C11.1 | IC2.42 14.81,10.44 v14.61,10.64 | IC2.5 18.02,11.85 v17.37,11.2 | USB-MCU.GND2 7.12,8.64 R48.2 | USB-MCU.GND 6.97,15.09 R46.2 | IC2.18 15.31,15.95 v15.09,15.72
  Top 0.305: R38.1 5,26.24 U3.6 | U3.4 0.75,25.59 0.41,25.93 0.41,29.74 | 0.41,29.74 0.74,30.07 0.94,30.07 C31.1 | 0.41,29.74 1.04,30.38 | C26.1 12.57,20.75 11.86,20.75 11.02,19.91 10.97,19.91 11.76,20.7 v13.44,20.7
  Top 0.406: U6.14 37,42.81 37.47,42.34 41.48,42.34 v41.53,42.39
  Bottom 0.254: SD-MCU.9 15.01,17.07 15.09,16.99 v15.09,15.72
  other vias: 21.34,9.17 25.17,13.26 27.08,11.89 14.17,3.1 14.43,11.86 5.54,4.83 1.96,11.07 28.96,19.25 27.69,14.35 41.07,15.72 31.67,10.29 54.69,13.28 32.41,30.2 45.62,34.14 54.1,42.19 54.31,49.58 67.26,50.11 70.13,48.41 62.13,46 69.72,37.13 53.14,38.43 53.31,35.28 49.2,33.22 42.8,34.06 22.33,26.67 22.96,29.06 16.59,24.77 17.2,22.99 22.81,18.85 50.75,19.35 50.65,10.39 33.35,12.14 27.08,10.52 22.45,22.56 3.15,6.43 6.99,24.92 0.69,31.19 9.32,50.83 12.14,50.93 10.26,49.81 13.54,50.09 18.41,50.22 23.14,50.32 5.38,51 5.54,47.93 9.25,48.18 4.9,31.37 0.64,25.02 32.97,25.88 23.39,25.88 33.17,28.35 23.42,27.74 31.04,32 22.58,37.11 29.79,42.52 49.07,41.91 47.7,40.13 44.5,42.37 70.21,51 73.25,47.42 73.41,42.52 72.69,36.58 73.96,34.67 74.24,30.99 74.22,28.88 63.91,39.93 63.93,45.59 53.19,23.39 57.25,24 42.85,15.72 60.4,12.4 67.61,17.55 69.01,2.49 66.45,2.51 70.92,0.76 70.41,3.71 74.37,4.01 31.11,28.19 33.17,24.21 37.08,32.54 36.6,29.79 45.49,30.99 15.9,41.68 1.55,13.36 1.47,5.03 4.06,5.38 4.93,1.52 16.59,10.59 9.35,2.72 14.33,1.09 23.19,1.68 68.2,48.69 72.8,17.5 69.93,8.94 56.26,6.55 55.58,10.03 56.46,12.6 47.22,9.8 50.11,5.54 43.13,11.79 42.62,10.49 13.84,47.32 18.03,10.49 37.59,38.2 38.46,38.13 61.93,14.38 68.15,9.6 19.43,44.91 73.51,41.15 43.23,22.76 51.49,23.27 12.7,25.6 8.43,39.29 7.62,39.29 10.19,9.19 6.96,16.66 16.33,29.9 14.1,29.92
  pour Bottom (isolate 0.305, rank 6): -1.27,-1.27 110,-1.27 110,80 -1.27,80
  pour Top (isolate 0.305, rank 6): -1.27,-1.27 110,-1.27 110,80 -1.27,80
I2C_SCL  (via drill 0.25)
  Top 0.254: U4.11 62.81,25.53 61.29,25.53 60.58,24.82 59.59,24.82 v59.33,24.56 | 58.9,23.72 R41.2 58.83,24.05 v59.33,24.56 | v59.33,24.56 59.49,24.71 | U6.55 45,14.95 45.74,15.7 59.13,15.7 v59.33,15.9
  Bottom 0.254: v59.33,15.9 v59.33,24.56
I2C_SDA  (via drill 0.25)
  Top 0.254: U4.12 63.6,25.37 63.25,25.02 61.72,25.02 61.11,24.41 | 61.11,24.41 R55.2 60.43,23.72 | v61.21,24.28 61.11,24.38 61.11,24.41 | U6.56 46,14.91 46.33,15.24 v60.1,15.24
  Bottom 0.254: v60.1,15.24 60.1,23.16 v61.21,24.28
ISET
  Top 0.406: U2.2 19.11,33.91 R29.2
MIC_N
  Top 0.254: C73.1 70.08,30.48 R63.2 C9.2 70.94,32 C14.2
MIC_P  (via drill 0.25)
  Top 0.254: C72.1 R64.1 69.19,33.35 v69.7,33.86 | FB3.1 v73.97,14.1
  Bottom 0.254: v73.97,14.1 69.7,18.36 v69.7,33.86
MICBIAS
  Top 0.254: U4.1 66.73,31.45 66.73,32.18 67.44,32.89 | 67.44,32.89 69.52,34.98 C69.2 | R64.2 67.44,32.87 67.44,32.89
MISO  (via drill 0.25)
  Top 0.254: v23.55,19.79 23.34,19.99 15.62,19.99 13.81,18.18 IC2.21
  Bottom 0.254: D1.6 23.76,22.62 23.57,22.43 23.57,21.29 SD-MCU.7 23.55,21.26 v23.55,19.79
MOSI  (via drill 0.25)
  Top 0.254: v19.15,18.9 19,19.05 16.51,19.05 16.31,19.05 16.28,19.02 14.81,17.55 IC2.19
  Bottom 0.254: D1.3 31.71,23.91 31.52,23.72 19.79,23.72 19.18,23.11 19.18,21.29 SD-MCU.3 v19.15,18.9
N$1
  Top 0.254: R4.1 37.9,9.63 R3.2 35.22,9.63 Q1.1
N$2
  Top 0.254: R6.1 34.73,6.4 STA.A
N$3
  Top 0.254: PWR.+ R7.2
N$4
  Top 0.254: Q1.3 32.94,9.15 STA.C
N$5
  Top 0.254: R16.1 40.87,11.28 Q6.1 39.48,10.02 R14.2
N$6
  Top 0.406: NET.A 39.97,6.43 R18.1
N$7
  Top 0.254: Q6.3 42.6,8.76 42.6,6.66 42.3,6.36 NET.C
N$8
  Top 0.254: U6.85 51,12.04 TP5.P$1
N$9
  Top 0.406: U1.5 12.22,37.82 12.09,37.69 9.94,37.69 R21.2 C25.2
N$10
  Top 0.61: U1.1 14.53,41.03 R20.2
N$11
  Top 0.406: R32.1 7.4,34.8 CHG.3
N$12
  Top 0.406: U2.7 11.18,33.91 10.64,33.38 10.01,33.38 R31.2
N$13
  Top 0.305: CHG.1 7.35,33.88 7.39,33.88
  Top 0.406: R31.1 7.95,33.33 7.39,33.88
N$14
  Top 0.406: R17.1 R37.1 70.92,17.02 71.96,18.06 71.96,18.58 R33.1 C16.2
N$15
  Top 0.406: FB3.2 73.97,18.3 R33.2 73.67,19.88 C20.2
N$16
  Top 0.254: R25.1 68.25,15.11 | R17.2 69.09,15.11 69.01,15.11 | EAR.2 68.63,13.19 | 68.63,14.73 68.63,15.11
  Top 0.406: 68.63,13.19 68.63,14.73 | 68.63,14.73 68.25,15.11 68.63,15.11 69.01,15.11 68.63,14.73
N$17
  Top 0.305: USB-LTE.A5 13.09,43.56 13.34,43.31 13.3,43.31 R26.1
N$19
  Top 0.305: USB-LTE.B5 10.09,43.54 9.98,43.43 9.96,43.43 9.86,43.33 R24.1
N$20
  Top 0.254: EAR.1 71.68,13.34 | R37.2 71.35,15.11 | R30.1 72.16,15.11 72.01,15.11 | 71.68,14.78 71.68,15.11
  Top 0.406: 71.68,13.34 71.68,14.78 | 71.68,14.78 71.35,15.11 71.68,15.11 72.01,15.11 71.68,14.78
N$21  (via drill 0.25)
  Top 0.254: 64.52,15.62 64.14,16 64.54,16.41 | C83.2 C79.2 65.81,22.63 v65.81,22.25 R66.1 | C81.1 64.54,15.98 | 64.54,15.98 64.54,16.41 | C78.1 64.54,16.74 64.54,16.56 64.54,16.41 | v63.75,15.95 63.78,15.98 64.54,15.98 | EAR.4 v64.62,6.02
  Bottom 0.254: v64.62,6.02 63.75,6.88 v63.75,15.95 63.75,20.19 v65.81,22.25
N$22
  Top 0.305: U3.3 2.38,26.24 arc-90 2.87,25.76
  Top 0.813: 2.87,25.76 2.87,22.16 arc-90 L5.1
N$23  (via drill 0.25)
  Top 0.305: U3.7 5.87,26.89 R38.2 | R38.2 5.94,26.8 5.97,26.77 | 9.53,19.1 C27.1 10.24,19.1 10.24,19.05 | 10.26,19.02 10.24,19.05 | 10.24,19.05 9.7,19.05 | 9.7,19.05 9.47,19.05 | 9.7,19.05 8.84,19.05 8.81,19.07 8.81,18.26 8.51,17.96 v8.08,17.96 | v6.78,26.11 6.07,26.82 R38.2
  Top 0.61: R42.1 8.84,19.02 10.26,19.02
  Bottom 0.305: v6.78,26.11 7.9,24.99 7.9,18.14 v8.08,17.96
N$24
  Bottom 0.254: U7.9 48.78,27.72 R23.2
N$25
  Top 0.254: USB-MCU.A5 7.29,13.11 7.8,13.61 R46.1
N$26
  Top 0.254: USB-MCU.B5 7.35,10.11 R48.1
N$27
  Top 0.305: U3.1 1.57,28.6 1.37,28.6 1.37,27.64 1.37,27.58 1.14,27.58 1.14,28.7 1.12,28.7 1.12,28.57 1.52,28.57 1.52,27.91 1.57,27.91 1.88,27.61 1.57,27.61 1.27,27.91 R43.1
N$28
  Top 0.305: 5.08,27.76 4.85,27.53 4.31,27.53 4.5,27.53 4.71,27.75 | 4.71,27.75 4.93,27.96 | U3.8 4.51,27.54 4.71,27.75
  Top 0.61: R44.1 5.71,28.5 5.69,28.47
  Top 0.813: 5.08,27.76 5.61,28.3 5.71,28.4 R44.1
N$40
  Top 0.254: R34.1 C36.2 U6.82
N$41
  Top 0.254: LTE_M.D 29.97,7.09 C41.2 R34.2
N$42  (via drill 0.25)
  Top 0.254: v34.95,41.68 47.17,41.68 48.01,42.52 U6.3 48,46.49 48.2,46.69 Q3.3 | v30.3,41.68 22.15,41.68 21.18,42.65 PWK.2
  Bottom 0.254: v30.3,41.68 v34.95,41.68
N$43
  Top 0.254: Q3.1 50.53,45.95 R36.2 R35.1
N$46
  Top 0.61: R60.1 VLTE.A
N$48
  Top 0.254: U4.2 64.6,30.21 65.43,31.04 C56.2 C55.2 C54.2 C53.2 L2.2
N$49
  Top 0.254: U4.13 64.1,25.14 62.92,23.95 62.92,23.47 C70.2 62.64,23.19 C71.2
N$50  (via drill 0.3)
  Top 0.254: U4.17 69,27.32 v69.01,27.3 70.76,27.3 C61.2 C63.2 71.32,25.58 C64.2 71.35,24.51 C62.2 | L4.2 60.86,20.52 v61.57,21.23
  Bottom 0.254: v69.01,27.3 69.01,25.15 67.74,23.88 64.21,23.88 v61.57,21.23
N$51
  Top 0.254: U4.18 67.95,27.82 68.53,28.4 70.36,28.4 C68.2
N$52
  Top 0.254: U4.4 63.6,30.33 C57.2 C59.2 C58.2 C60.2 L3.2
N$54
  Top 0.254: U4.19 66.67,28.32 67.69,29.34 C73.2
N$57
  Top 0.254: U4.10 61.03,26.82 60.88,26.67 58.73,26.67 | 58.73,26.67 58.45,26.67 | 58.45,26.67 58.45,26.95 | 58.45,26.95 R62.1 | C67.2 58.45,26.67 | 58.45,26.95 58.73,26.67 | 58.73,26.67 58.47,26.42
N$58
  Top 0.254: U4.20 66.1,29.57 C72.2
N$59
  Top 0.254: R65.2 63.73,18.34 62.45,19.62 FB1.2
N$63
  Top 0.406: R66.2 65.87,19.88 FB2.2
N$64
  Top 0.406: EAR.3 66.06,13.06 C81.2 66.02,15.27 C78.2 66.04,16.82 R65.1 66.09,18.39 C80.1 C82.1
N$69
  Top 0.254: U6.4 47,46.19 46.46,46.74 Q5.3
N$70
  Top 0.254: R67.2 42.55,47.45 R68.1 | 42.7,47.35 R68.1 | Q5.1 42.78,47.69 R68.1
N$72
  Top 0.254: R39.2 C43.2 49.02,7.14 LET_A.D
N$73
  Top 0.406: R40.1 L1.1 C44.1
N$74
  Top 0.254: U6.59 C42.2 R39.1
N$75
  Top 0.61: U6.79 57.23,37.39 arc90 58.45,38.61 C45.2
N$76
  Top 0.61: C45.1 L1.2 GPS.D
N$94
  Top 0.254: R56.2 R57.1 45.8,6.57 Q4.1
NETLED
  Top 0.254: U6.51 41,12.67 R16.2
PA00_XIN32
  Top 0.254: IC2.1 19.34,7.26 C5.1 19.74,5.14 X1.P$2
PA01_XOUT32
  Top 0.254: IC2.2 20.03,10.35 20.27,10.11 20.27,7.98 C3.1 22.1,6.14 X1.P$1
PCM_CLK  (via drill 0.25)
  Top 0.254: U4.9 60.16,27.32 R62.2 59.97,28.09 58.22,29.84 v57.53,29.84 | U6.76 55.52,34.37 v57.53,34.37
  Bottom 0.254: v57.53,29.84 57.73,30.05 57.73,34.16 v57.53,34.37
PCM_IN
  Top 0.254: U4.6 61.86,28.82 58.27,32.41 55.52,32.41 U6.74
PCM_OUT
  Top 0.254: U4.7 61.62,28.32 58.55,31.39 U6.73
PCM_SYNC  (via drill 0.25)
  Top 0.254: U4.8 61.28,27.82 58.45,30.66 v57.1,30.66 | v57.1,33.38 55.52,33.38 U6.75
  Bottom 0.254: v57.1,33.38 v57.1,30.66
RESET
  Top 0.254: RESET.P$1 12.12,4.34 C19.2 R1.1 13.06,7.21 13.51,7.21 13.81,7.51 IC2.40 | CN2.10 24.99,2.81 J8.11
  Bottom 0.254: CN2.10 19.91,4.62 13.18,4.62 12.12,3.56 RESET.P$1
RI  (via drill 0.3)
  Top 0.254: U6.69 48.75,27.39 v48.11,26.75
  Bottom 0.254: v48.11,26.75 48.11,25.28 U7.8
RTS  (via drill 0.3)
  Top 0.254: U6.66 48.77,24.39 47.4,23.01 v46.02,23.01
  Bottom 0.254: U7.4 45.54,25.24 45.54,24.03 46.02,23.55 v46.02,23.01
RXD  (via drill 0.3)
  Top 0.254: v45.09,23.34 46.35,24.61 47.3,24.61 49.07,26.39 U6.68
  Bottom 0.254: U7.3 | U7.3 44.88,23.55 v45.09,23.34
  Bottom 0.406: Q8.2 38.29,24.26 R28.1 38.18,24.4 38.18,25.6 40.11,27.53 44.27,27.53 44.88,26.92 U7.3
SCK  (via drill 0.25)
  Top 0.254: v21.36,19.41 21.23,19.53 15.95,19.53 14.3,17.88 IC2.20
  Bottom 0.254: D1.5 30.96,23.04 30.76,23.24 21.59,23.24 21.36,23.01 SD-MCU.5 v21.36,19.41
SCL  (via drill 0.25)
  Top 0.254: IC2.32 11.42,11.85 11.66,11.61 v11.66,9.2 | v35.66,3.43 36.45,3.43 36.96,3.94 59.21,3.94 J3.2 | R9.1 v61.09,7.37
  Bottom 0.254: v35.66,3.43 33.81,5.28 23.9,5.28 22.23,6.96 16.89,6.96 16,7.85 12.37,7.85 11.66,8.56 v11.66,9.2 | J3.2 v61.09,7.37
SD_CMD  (via drill 0.25)
  Top 0.254: D9.3 23.68,38.39 U6.21 26.94,38.39 27.23,38.1 35.23,38.1 v35.94,37.39
  Bottom 0.254: 35.94,36.06 v35.94,37.39
  Bottom 0.406: SD-LTE.3 35.94,36.06
SD_DATA0  (via drill 0.25)
  Top 0.254: v21.34,34.77 D9.6 | U6.22 24.2,37.39 v23.9,37.69 | U6.22 v31.5,37.39
  Top 0.406: U6.22
  Bottom 0.254: SD-LTE.7 31.5,36.07 v31.5,37.39 | v21.34,34.77 23.9,37.34 v23.9,37.69
SD_DATA1  (via drill 0.25)
  Top 0.254: 25.52,36.37 v29.52,36.37
  Top 0.406: U6.23 25.52,36.37
  Bottom 0.254: SD-LTE.8 30.09,36.37 v29.52,36.37
SD_DATA2  (via drill 0.25)
  Top 0.254: U6.24 37.46,35.39 v38.12,34.72
  Bottom 0.254: SD-LTE.1 v38.12,34.72
  Bottom 0.406: v38.12,34.72
SD_DATA3  (via drill 0.3)
  Top 0.254: D9.1 23.11,35.61 24.33,34.39 U6.25 36.91,34.39 v37.03,34.39
  Bottom 0.254: SD-LTE.2 37.02,34.4 v37.03,34.39
  Bottom 0.406: 37.03,36.03 SD-LTE.2
SD_SCK  (via drill 0.25)
  Top 0.254: D9.5 21.67,37.08 22.05,36.7 22.05,35.08 23.73,33.39 U6.26 33.7,33.39 v33.71,33.4
  Bottom 0.254: SD-LTE.5 33.71,36.02 v33.71,33.4
SDA  (via drill 0.25)
  Top 0.254: v35.76,4.27 35.92,4.42 59.77,4.42 | 59.77,4.42 60.07,4.42 | 60.07,4.42 60.38,4.42 | 60.38,4.42 62.92,4.42 63.63,3.71 J3.1 | IC2.31 11.78,12.35 12.37,11.76 v12.37,9.73 | R11.1 60.07,4.72 | 60.07,4.72 60.07,4.42 | 59.77,4.42 60.07,4.72 | 60.07,4.72 60.38,4.42
  Bottom 0.254: v35.76,4.27 34.29,5.74 24.18,5.74 22.5,7.42 17.14,7.42 16.23,8.33 13.21,8.33 12.37,9.17 v12.37,9.73
SIM_CLK  (via drill 0.3)
  Top 0.254: U6.19 32,42.14 34.14,40.01 45.01,40.01 47.55,37.47 v48.51,37.47
  Bottom 0.254: SIM.3 50.25,35.75 48.54,37.47 v48.51,37.47 47.83,37.47 D10.4
SIM_DATA  (via drill 0.3)
  Top 0.254: U6.17 34,41.62 34.59,41.02 45.52,41.02 47.27,39.27 v48.92,39.27 49.63,38.56 v49.63,37.54
  Bottom 0.254: D10.3 47.83,39.27 v48.92,39.27 | SIM.7 50.15,37.02 v49.63,37.54
SIM_RST  (via drill 0.3)
  Top 0.254: U6.18 33,41.88 34.34,40.54 45.19,40.54 47.43,38.29 v48.81,38.29
  Bottom 0.254: D10.5 47.07,37.9 47.46,38.29 v48.81,38.29 SIM.2
SIM_VDD  (via drill 0.3)
  Top 0.406: U6.20 31,42.33 33.91,39.42 44.73,39.42 45.47,38.68 v45.47,37.49
  Bottom 0.406: C52.2 D10.6 46.28,37.49 v45.47,37.49 45.47,40.23 46.06,40.83 SIM.1
SPK_N
  Top 0.406: SPK.+ 66.03,41.5 C30.2 C33.1 L7.2
  Top 0.813: J1.2 69.71,41.27 SPK.+
SPK_P
  Top 0.406: SPK.- 63.76,43.27 C30.1 C34.1 L6.2
  Top 0.813: J1.1 69.86,43.27 SPK.-
SPKOUT_N  (via drill 0.25)
  Top 0.254: U4.16 66.75,26.82 v67.67,25.91 | L7.1 v60.55,38.96
  Bottom 0.254: v60.55,38.96 64.38,38.96 67.79,35.55 67.79,26.04 v67.67,25.91
SPKOUT_P  (via drill 0.25)
  Top 0.254: U4.14 v64.6,24.54 v64.59,24.54 | L6.1 60.58,44.58 v60.58,45.64
  Bottom 0.254: v60.58,45.64 68.33,37.9 68.33,25.4 67.46,24.54 v64.59,24.54
STATUS
  Top 0.254: U6.49 39,12.2 R4.2
SWCLK  (via drill 0.25)
  Top 0.254: IC2.45 16.31,4.13 v16.48,3.96
  Bottom 0.254: v16.48,3.96 17.48,3.96 17.91,3.53 CN2.4
SWDIO
  Top 0.254: IC2.46 16.81,5.36 17.45,4.72 17.45,3.89 16.64,3.07 CN2.2
TXD  (via drill 0.25)
  Top 0.406: U6.71 48.26,29.39 44.12,25.25 v42.62,25.25
  Bottom 0.305: v42.61,25.25 v42.62,25.25
  Bottom 0.406: Q7.2 41.84,24.18 R27.1 v42.61,25.25 U7.1
V4D2
  Top 0.254: 13.97,22.48 13.74,22.48 C26.2
  Top 0.305: 4.17,25.07 4.12,25.12 4.12,25.55 4.16,25.59 U3.5 4.09,25.51 4.09,25.09 4.17,25.17 4.17,25.25
  Top 0.61: 4.09,25.09 4.47,25.09 4.47,25.32 4.6,25.32 4.6,24.77 4.32,24.77 4.32,25.2 | C21.2 11.66,21.79 12.06,22.2 12.06,22.1 C21.2
  Top 0.813: D11.A 14.36,23.11 R15.1 12.66,23.08 12.17,23.08 | 12.17,23.08 Q2.1 | 12.06,22.2 12.06,22.71 | 12.06,22.71 12.06,23.08 12.17,23.08 | 12.06,22.2 12.06,22.71 | 7.04,21.29 7.04,21.79 7.04,22.71 6.99,22.71 6.48,22.71 4.09,25.09 | 7.04,21.29 L5.2 | 7.04,21.29 7.04,20.62 | 7.04,20.62 C27.2 | R42.2 10.46,20.6 12.06,22.2 | 6.91,19.13 6.88,19.15 6.88,20.47 7.04,20.62
  Top 1.016: 12.06,22.71 7.04,22.71 | 7.04,22.71 7.04,21.79 11.66,21.79 11.66,22.1 10.39,22.1 10.39,20.95 7.01,20.95 7.01,21.06 6.99,21.06 6.99,22.71 7.04,22.71
  Top 1.27: 12.06,22.2 13.69,22.2 13.97,22.48
  pour Top: 4.75,25.58 3.71,25.58 3.71,25.12 4.75,25.12
V_BATT  (via drill 0.25)
  Top 0.254: C12.2 C8.2 R19.1 19.41,27.99 R60.2 | U6.38 25.5,20.88 | 25.5,20.88 U6.39 v53.49,20.39 | 54.71,20.39 U6.62 | U6.62 U6.63 | U6.62 58.02,20.39 | D8.C 19.39,22.08 C47.2 20.27,20.93 C48.A 25.45,20.93 25.5,20.88
  Top 0.406: v53.49,20.39 54.71,20.39 | v39.55,7.47 38.05,7.47 R18.2 35.89,7.95 R6.2
  Top 0.61: R19.1 19.23,27.79 19.18,27.74 19.2,27.71 19.28,27.71 19.3,27.69 19.36,27.64 19.36,22.02 20.42,20.95 58.19,20.95 L4.1 58.49,20.39 58.02,20.39
  Top 1.016: D8.C 19.39,27.78 19.3,27.86 | 19.3,27.86 19.3,27.91 R19.1 R45.1 | 19.15,27.74 19.18,27.74 19.3,27.86 | 19.3,27.86 19.3,27.69 19.3,25.4 C46.2
  Bottom 0.406: v53.49,20.39 53.47,20.37 53.47,10.92 50.01,7.47 v39.55,7.47
  pour Top: 17.14,29.87 17.14,29.01 18.52,29.01 18.77,28.75 18.77,21.18 19.48,20.47 24.28,20.47 24.54,20.22 57.35,20.22 57.63,19.94 58.47,19.94 58.47,21.08 57.2,21.08 56.72,21.56 20.93,21.56 20.55,21.95 20.55,26.52 21.46,27.43 21.46,28.45 20.29,28.45 20.09,28.65 20.09,29.84 20.09,29.87
VBAT+  (via drill 0.25)
  Top 0.254: 9.4,36.54 R21.1 U2.5
  Top 0.305: 13.79,37.03 v13.81,37.05 v13.82,37.06
  Top 1.016: U2.5 12.05,36.54 v12.7,36.54 13.21,37.05 v13.81,37.05
  Top 1.27: BAT.2 6.07,42.64 6.07,41.99 6.07,36.63 6.33,36.37 7.71,36.37 C22.1 7.92,36.45 U2.5
  Bottom 0.254: 13.21,36.45 12.8,36.45 12.7,36.55 v12.7,36.54
  Bottom 1.016: J2.11 25.8,49.04 13.3,36.54 v12.7,36.54
  Bottom 1.27: BAT.2 5.45,42.29 J4.1
  pour Top: 3.63,36.53 6.93,36.53 6.96,36.5 6.96,35.94 5.56,35.94 4.6,34.98 4.6,34.32 3.35,34.32 3.35,36.25
VBAT-
  Top 0.61: U1.6 13.18,38.64 13.18,39.47 12.83,39.83 11.68,39.83 11.27,40.24 U1.3 11.1,41.2 C25.1 | 8,42.98 9.09,41.88 7.98,41.88 R22.1
  Top 1.016: C25.1 9.42,41.27 8.69,42.01 8.03,42.01 8,42.04 | BAT.1 6.34,44.64 7.11,43.87 7.95,43.03 8,42.98 | 8,42.04 8,42.98 | 8,42.04 8,42.98
  Bottom 1.27: BAT.1 5.24,45.19 J4.2
VBAT_IN
  Top 0.813: Q2.3 8.36,24.73 8.36,25.73 8.36,26.47 D4.A 7.52,27.22 R5.2
  Top 1.016: R5.2 6.99,29.29 6.99,30.96 5.38,32.56 4.06,32.56 SW1.CH1A
VBUS  (via drill 0.25)
  Top 0.254: USB-MCU.VBUS2 5.65,9.41 4.32,10.74 4.32,12.95 v4.29,12.98 5.62,14.31 USB-MCU.VBUS1
  Top 0.406: 4.29,13.01 v4.29,12.98 4.29,12.95 | U2.4 18.16,37.91 C23.1 | C23.1 18.15,38.83 D2.C | v16.59,37.74 17.97,37.74 C23.1 | v7.44,32.31 7.44,32.33 5.93,33.85 | 5.93,33.85 5.92,33.86 | 5.92,33.86 5.89,33.88 | 5.89,33.88 5.89,33.86 | CHG.2 5.93,33.85 | 5.89,33.88 5.89,33.91 | CHG.2 7.44,32.35 7.44,32.28 7.42,32.31 | 7.42,32.31 5.92,33.81 5.92,33.86 | CHG.2 7.42,32.38 | 7.42,32.38 7.42,32.33 7.34,32.33 7.32,32.36 5.94,33.73 5.94,33.81 | CHG.2 7.42,32.38 | 7.42,32.38 7.42,32.31 | 3.83,13.44 v3.86,13.46
  Top 0.813: 11.18,32.31 v11.15,32.31 11.3,32.46 11.48,32.64 U2.8
  Top 1.016: 4.29,12.95 3.53,13.72 3.56,13.72 3.83,13.44
  Bottom 0.305: 2.82,29.69 2.72,29.59 2.72,29.57 | 3.3,28.96 3.3,28.98 | 3.28,29.16 3.28,28.5
  Bottom 0.406: 7.37,32.31 7.39,32.31 7.42,32.31 | 7.42,32.31 v7.44,32.31 | 7.42,32.33 7.44,32.33 | 7.44,32.33 v7.44,32.31 | v7.44,32.31 7.42,32.31 | 7.42,32.31 7.42,32.33 | 7.42,32.33 7.44,32.33 | 7.44,32.33 7.42,32.33 | 3.25,28.98 3.3,28.98
  Bottom 0.813: v16.59,37.74 v11.15,32.31 v7.44,32.31 | v7.44,32.31 7.42,32.31 | 7.42,32.31 7.39,32.31 | 7.39,32.31 7.37,32.31 7.39,32.31 | 7.39,32.31 7.42,32.31 | 7.42,32.31 v7.44,32.31 | 7.39,32.31 7.42,32.33 7.39,32.33 | 7.39,32.31 7.37,32.28 | 7.37,32.28 3.58,28.5 3.28,28.5 | 3.28,29.16 3.3,29.13 4.14,29.13 | v7.44,32.31 7.42,32.28 | 7.42,32.28 v7.44,32.31 | v7.44,32.31 7.42,32.28 | 7.42,32.28 7.39,32.28 7.42,32.31 | v7.44,32.31 7.42,32.31 | 7.42,32.31 7.39,32.33 | 7.39,32.33 7.37,32.33 | 7.42,32.31 7.42,32.28 | 3.3,28.96 3.48,29.13 4.14,29.13 | 4.14,29.13 7.32,32.31 | 7.32,32.31 7.34,32.31 | 7.34,32.31 7.39,32.31 | 7.42,32.28 7.39,32.31 | 7.39,32.31 7.34,32.31 | 7.39,32.33 7.32,32.26 7.34,32.28 7.37,32.28 | 7.37,32.28 7.34,32.31 | 7.39,32.31 7.34,32.31 | 7.34,32.31 7.32,32.31 | 4.14,29.13 7.32,32.31 | 7.32,32.31 7.34,32.31 | 7.34,32.31 7.39,32.31 | 7.39,32.31 7.34,32.31 | 7.37,32.33 7.34,32.33 7.37,32.33 | 7.37,32.33 7.34,32.31 | 7.34,32.31 7.32,32.31 | 7.32,32.31 7.29,32.31 7.32,32.33 | 7.34,32.31 7.32,32.31 | 7.34,32.31 7.32,32.31
  Bottom 1.016: v4.29,12.98 3.3,13.97 2.85,14.43 2.85,29.08 | 3.3,28.98 2.72,29.57 2.56,29.72 2.56,33.73 SW1.COM2 | 2.85,29.08 2.85,29.13 | 2.85,29.13 2.85,29.16 2.85,29.13 | 3.3,28.96 3.12,29.13 2.85,29.13 | 2.85,29.13 2.85,29.08 | 2.85,29.13 2.9,29.08 2.9,28.91
  other vias: 17.07,38.18
  pour Top: 6.65,9.14 5.16,9.14 3.73,10.57 3.73,13.08 5.33,14.68 6.65,14.68 6.65,14.02 5.71,14.02 4.72,13.03 4.67,12.98 4.67,10.59 5.51,9.75 6.65,9.75
  pour Top: 18.75,36.25 18.75,38.56 18.29,39.01 16.38,39.01 16.31,38.94 16.31,37.77 17.4,36.68 17.4,36.27 17.4,36.25
VDDCORE
  Top 0.254: IC2.43 15.31,7.72 14.81,7.21 14.45,7.21 C7.1
VIN
  Top 0.254: C17.2 C10.2 | 10.75,28.11 10.75,27.76 10.8,27.81 13.74,27.81 13.81,27.88
  Top 0.305: 14.12,28.17 13.81,28.17 13.81,27.88 | 10.75,28.11 10.75,28.35 11,28.6 14.02,28.6 14.2,28.42 11.61,28.42 C17.2
  Top 0.813: D11.C 14.12,26.59 14.12,28.17 | 14.12,28.17 14.12,28.4 14.1,28.4 14.1,28.17 14.12,28.17
  pour Top: 11.73,24.69 9.93,24.69 9.93,27.53 11.07,28.68 14.53,28.68 14.53,27.84 13,27.84 11.73,26.57
  pour Top: 18.01,28.22 16.1,28.22 16.1,26.44 18.01,26.44
VSYS  (via drill 0.25)
  Top 0.305: 2.87,27.03 2.74,26.89 2.73,26.9 2.44,26.9 | 2.44,26.9 U3.2 | U3.2 1.14,26.9 | 1.14,26.9 U3.2 | U3.2 2.44,26.9 | 2.44,26.9 2.74,27.2 2.77,27.2 | v4.6,17.22 1.93,17.22 v1.78,17.37 | 1.14,26.9 U3.2 | U3.2 | 2.87,29.06 2.87,28.88 2.82,28.88 R43.2 | 3.33,30.3 3.3,30.28
  Top 0.61: 2.87,27.03 2.87,28.88 2.87,29.06 3.12,29.06 | 2.79,30.33 2.95,30.33 C31.2 2.74,30.3 2.82,30.3 | C28.2 4.04,30.43 3.45,30.43 3.33,30.3 2.82,30.3 | 2.82,30.3 2.77,30.3
  Top 0.813: 2.87,29.06 3.12,29.06 3.3,29.06 arc90 3.45,28.91 R44.2
  Top 1.27: 3.3,30.33 3.3,30.28 3.3,29.06 | 3.45,30.43 1.12,32.77 0.96,32.77 0.99,32.74 SW1.CH2A
  Bottom 0.305: R10.2 5.13,17.75 v4.6,17.22 | v1.78,17.37 1.78,28.57 1.78,28.96 1.57,29.16 1.57,31.47 1.02,32.03 SW1.CH2A
VUSB  (via drill 0.25, 0.3)
  Top 0.61: USB-LTE.VBUS2 9.39,44.69 v9.37,44.68 | v14.3,44.68 14.29,44.69 USB-LTE.VBUS1 | U6.11 40,46.28 38.84,47.45 18.52,47.45 17.63,46.56 17.63,45.67 v17.63,45.03 17.63,43.91 D2.A 16.83,44.2
  Bottom 0.61: v9.37,44.68 v14.3,44.68 14.78,44.2 16.83,44.2 17.63,44.99 v17.63,45.03

## Text on the board
tPlace: VBAT | GND | 3V3 | D8 | D7 | D9 | TP6 | - | + | + | OFF | VBAT | - | ON | TP5 | SWD | RST | D13 | D12 | D11 | D10 | A0 | A1 | A2 | A3 | A4 | A5 | GND | 3V3 | SCL | SDA
bPlace: VBAT | D8 | D7 | D6 | - | GND | 3V3 | D9 | D5 | D4 | D3 | D2 | + | - | + | OFF | ON | Maduino Zero | 4G LTE CAT4 SIM7600X v1.3 | www.makerfabs.com | RST | D13 | D12 | D11 | D10 | A0 | A1 | A2 | A3 | A4 | A5 | GND | 3V3 | SCL | SDA